# Altium project PT-MIS-PCB-007_v1.PrjPcb
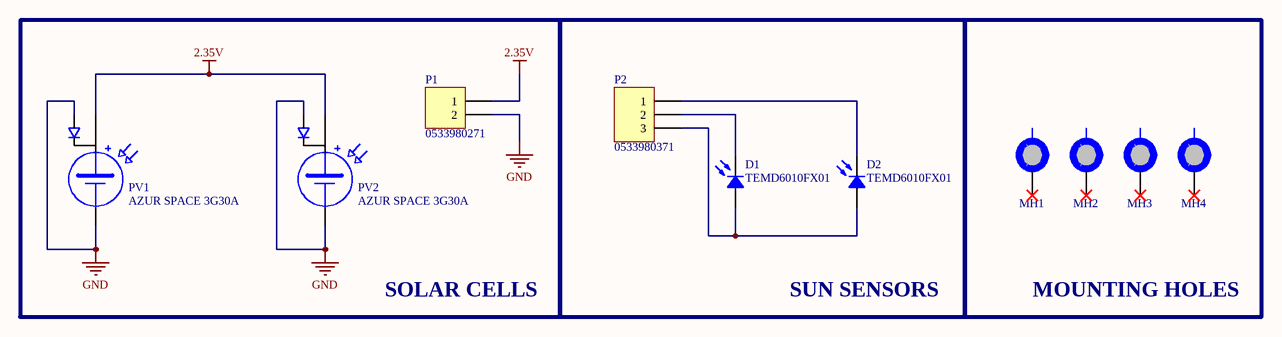
[diagram p0: [03] - SCHEMATIC.SchDoc]
1 sheet, 10 parts. Net scope: global (net labels, ports and power ports of the same name join across sheets).
Board file: PT-MIS-PCB-007_v1 PCB.PcbDoc

## Sheet [03] - SCHEMATIC.SchDoc
size A4

### Parts
D1  TEMD6010FX01  [TEMD6010FX01]
D2  TEMD6010FX01  [TEMD6010FX01]
MH1  MH_3.8MMNC_2.5MMD  [MH_3.8MMNC_2MMD_NON_COPPER_NPTH]  (value not drawn)  (no BOM)
MH2  MH_3.8MMNC_2.5MMD  [MH_3.8MMNC_2MMD_NON_COPPER_NPTH]  (value not drawn)  (no BOM)
MH3  MH_3.8MMNC_2.5MMD  [MH_3.8MMNC_2MMD_NON_COPPER_NPTH]  (value not drawn)  (no BOM)
MH4  MH_3.8MMNC_2.5MMD  [MH_3.8MMNC_2MMD_NON_COPPER_NPTH]  (value not drawn)  (no BOM)
P1  0533980271  [0533980271]
P2  0533980371  [0533980371]
PV1  AZUR SPACE 3G30A  [AZUR SPACE 3G30A]
PV2  AZUR SPACE 3G30A  [AZUR SPACE 3G30A]

### Blocks framed on the sheet
SOLAR CELLS: P1 PV1 PV2
SUN SENSORS: D1 D2 P2
MOUNTING HOLES: MH1-MH4

### Nets
2.35V: P1.1 PV1.1 PV2.1
GND: P1.2 PV1.2 PV1.3 PV2.2 PV2.3
NetD1_1: D1.1 D2.1 P2.3
NetD1_2: D1.2 P2.2
NetD2_2: D2.2 P2.1

Not connected (* = marked no-connect by the designer): MH1 1; MH2 1; MH3 1; MH4 1

### Library data of the parts
D1 D2 = TEMD6010FX01: Ambient Light Sensor; Manufacturer: Vishay Semiconductors; Product Training Modules: Ambient Light Sensors; Catalog Drawings: TEMx60x0(F)X01; Featured Product: Surface-Mount Ambient Light Sensing Photodiodes; Wavelength: 540nm; Spectral Range: 430nm ~ 610nm; Diode Type: PIN; Voltage - DC Reverse (Vr) (Max): 16V; Current - Dark (Typ): 2nA; Active Area: 0.27mm²; Viewing Angle: 120°; Other Names: 751-1051-2; Supplier 1: Digi-Key; Manufacturer Part Number: TEMD6010FX01; Stock 1: 29; Pricing 1: 1=2.26, 10=1.998, 25=1.4824, 100=1.2892, 250=1.1603, 500=1.0314, 1000=0.8863 (USD); Standard Package: 3,000; Category: Sensors, Transducers; Family: Optical Sensors - Photodiodes; Packaging: Tape & Reel (TR); Operating Temperature: -40°C ~ 100°C; Mounting Type: Surface Mount; Online Catalog: Ambient Light Sensor; ComponentLink1URL: https://datasheet.ciiva.com/8280/temd6010-8280593.pdf; ComponentLink1Description: https://datasheet.ciiva.com/8280/temd6010-8280593.pdf; ComponentLink2URL: https://datasheet.ciiva.com/1252/temd6010-1252130.pdf; ComponentLink2Description: https://datasheet.ciiva.com/1252/temd6010-1252130.pdf; ComponentLink3URL: https://datasheet.ciiva.com/2819/temd6010-2819730.pdf; ComponentLink3Description: https://datasheet.ciiva.com/2819/temd6010-2819730.pdf; ComponentLink4URL: https://datasheet.ciiva.com/2819/temd6010-2819731.pdf; ComponentLink4Description: https://datasheet.ciiva.com/2819/temd6010-2819731.pdf; ComponentLink5URL: https://datasheet.ciiva.com/2819/temd6010-2819732.pdf; ComponentLink5Description: https://datasheet.ciiva.com/2819/temd6010-2819732.pdf; ComponentLink6URL: https://datasheet.ciiva.com/4270/temd6010-4270070.pdf; ComponentLink6Description: https://datasheet.ciiva.com/4270/temd6010-4270070.pdf; ComponentLink7URL: https://datasheet.ciiva.com/46430/1794172-46430214.pdf; ComponentLink7Description: https://datasheet.ciiva.com/46430/1794172-46430214.pdf; ComponentLink8URL: https://datasheet.ciiva.com/1249/temd6010-1249179.pdf; ComponentLink8Description: https://datasheet.ciiva.com/1249/temd6010-1249179.pdf; ComponentLink9URL: https://datasheet.ciiva.com/4697/temd6010-102586-4697659.pdf; ComponentLink9Description: https://datasheet.ciiva.com/4697/temd6010-102586-4697659.pdf; Supplier Part Number 1: 751-1051-1-ND
MH1-MH4 = MH_3.8MMNC_2MMD: Mounting Hole 3.8mm Diameter (Non Copper), 2.5mm Drill NPTH
P1 = 0533980271: 2 Positions Header, Shrouded Connector 0.049" (1.25mm) Surface Mount, Right Angle Tin; Manufacturer: Molex; Number of Positions: 2; Number of Positions Loaded: All; Supplier 1: Digi-Key; Manufacturer Part Number: 0533980271; Stock 1: 25214; Pricing 1: 1=0.88, 10=0.778, 100=0.6713, 500=0.5493 (USD); Category: Connectors, Interconnects; Family: Rectangular Connectors - Headers, Male Pins; Series: PicoBlade™ 53398; Packaging: Cut Tape (CT); Contact Type: Blade Pin; Connector Type: Header, Shrouded; Pitch: 0.049" (1.25mm); Number of Rows: 1; Row Spacing: -; Contact Mating Length: -; Mounting Type: Surface Mount; Termination: Solder; Fastening Type: -; Features: Solder Retention; Contact Finish: Tin; Contact Finish Thickness: 39µin (1.00µm); Color: Natural; ComponentLink1URL: https://datasheet.ciiva.com/6813/533980271-sd-6813860.pdf; ComponentLink1Description: https://datasheet.ciiva.com/6813/533980271-sd-6813860.pdf; ComponentLink2URL: https://datasheet.ciiva.com/3117/0533980271-pcb-headers-3117624.pdf; ComponentLink2Description: https://datasheet.ciiva.com/3117/0533980271-pcb-headers-3117624.pdf; ComponentLink3URL: https://datasheet.ciiva.com/3117/0533980271-pcb-headers-3117625.pdf; ComponentLink3Description: https://datasheet.ciiva.com/3117/0533980271-pcb-headers-3117625.pdf; ComponentLink4URL: https://datasheet.ciiva.com/6813/533980271-sd-6813869.pdf; ComponentLink4Description: https://datasheet.ciiva.com/6813/533980271-sd-6813869.pdf; Supplier Part Number 1: WM7606CT-ND
P2 = 0533980371: 3 Positions Header, Shrouded Connector 0.049" (1.25mm) Surface Mount Tin; Manufacturer: Molex; Number of Positions: 3; Number of Positions Loaded: All; Supplier 1: Digi-Key; Manufacturer Part Number: 0533980371; Stock 1: 26974; Pricing 1: 1=1.07, 10=0.942, 100=0.8126, 500=0.6649 (USD); Category: Connectors, Interconnects; Family: Rectangular Connectors - Headers, Male Pins; Series: PicoBlade™ 53398; Packaging: Digi-Reel®; Contact Type: Blade Pin; Connector Type: Header, Shrouded; Pitch: 0.049" (1.25mm); Number of Rows: 1; Row Spacing: -; Contact Mating Length: -; Mounting Type: Surface Mount; Termination: Solder; Fastening Type: -; Features: Solder Retention; Contact Finish: Tin; Contact Finish Thickness: 39µin (1.00µm); Color: Natural; ComponentLink1URL: https://datasheet.ciiva.com/6813/533980271-sd-6813860.pdf; ComponentLink1Description: https://datasheet.ciiva.com/6813/533980271-sd-6813860.pdf; ComponentLink2URL: https://datasheet.ciiva.com/3117/0533980371-pcb-headers-3117626.pdf; ComponentLink2Description: https://datasheet.ciiva.com/3117/0533980371-pcb-headers-3117626.pdf; ComponentLink3URL: https://datasheet.ciiva.com/3117/0533980371-pcb-headers-3117627.pdf; ComponentLink3Description: https://datasheet.ciiva.com/3117/0533980371-pcb-headers-3117627.pdf; Supplier Part Number 1: WM7607CT-ND
PV1 PV2 = AZUR SPACE 3G30A: 30% Triple Junction GaAs Solar Cell Assembly; Average Open Circuit (BOL): 2690 mV; Average Short Circuit (BOL): 519.6 mA; Voltage at max.Power: 2409 mV; Current at max. Power: 502.9 mA; Average Efficiency (1367 W/m^2): 29.3; Average Efficiency (1353 W/m^2): 29.6